# Altium project light_controller.PrjPcb
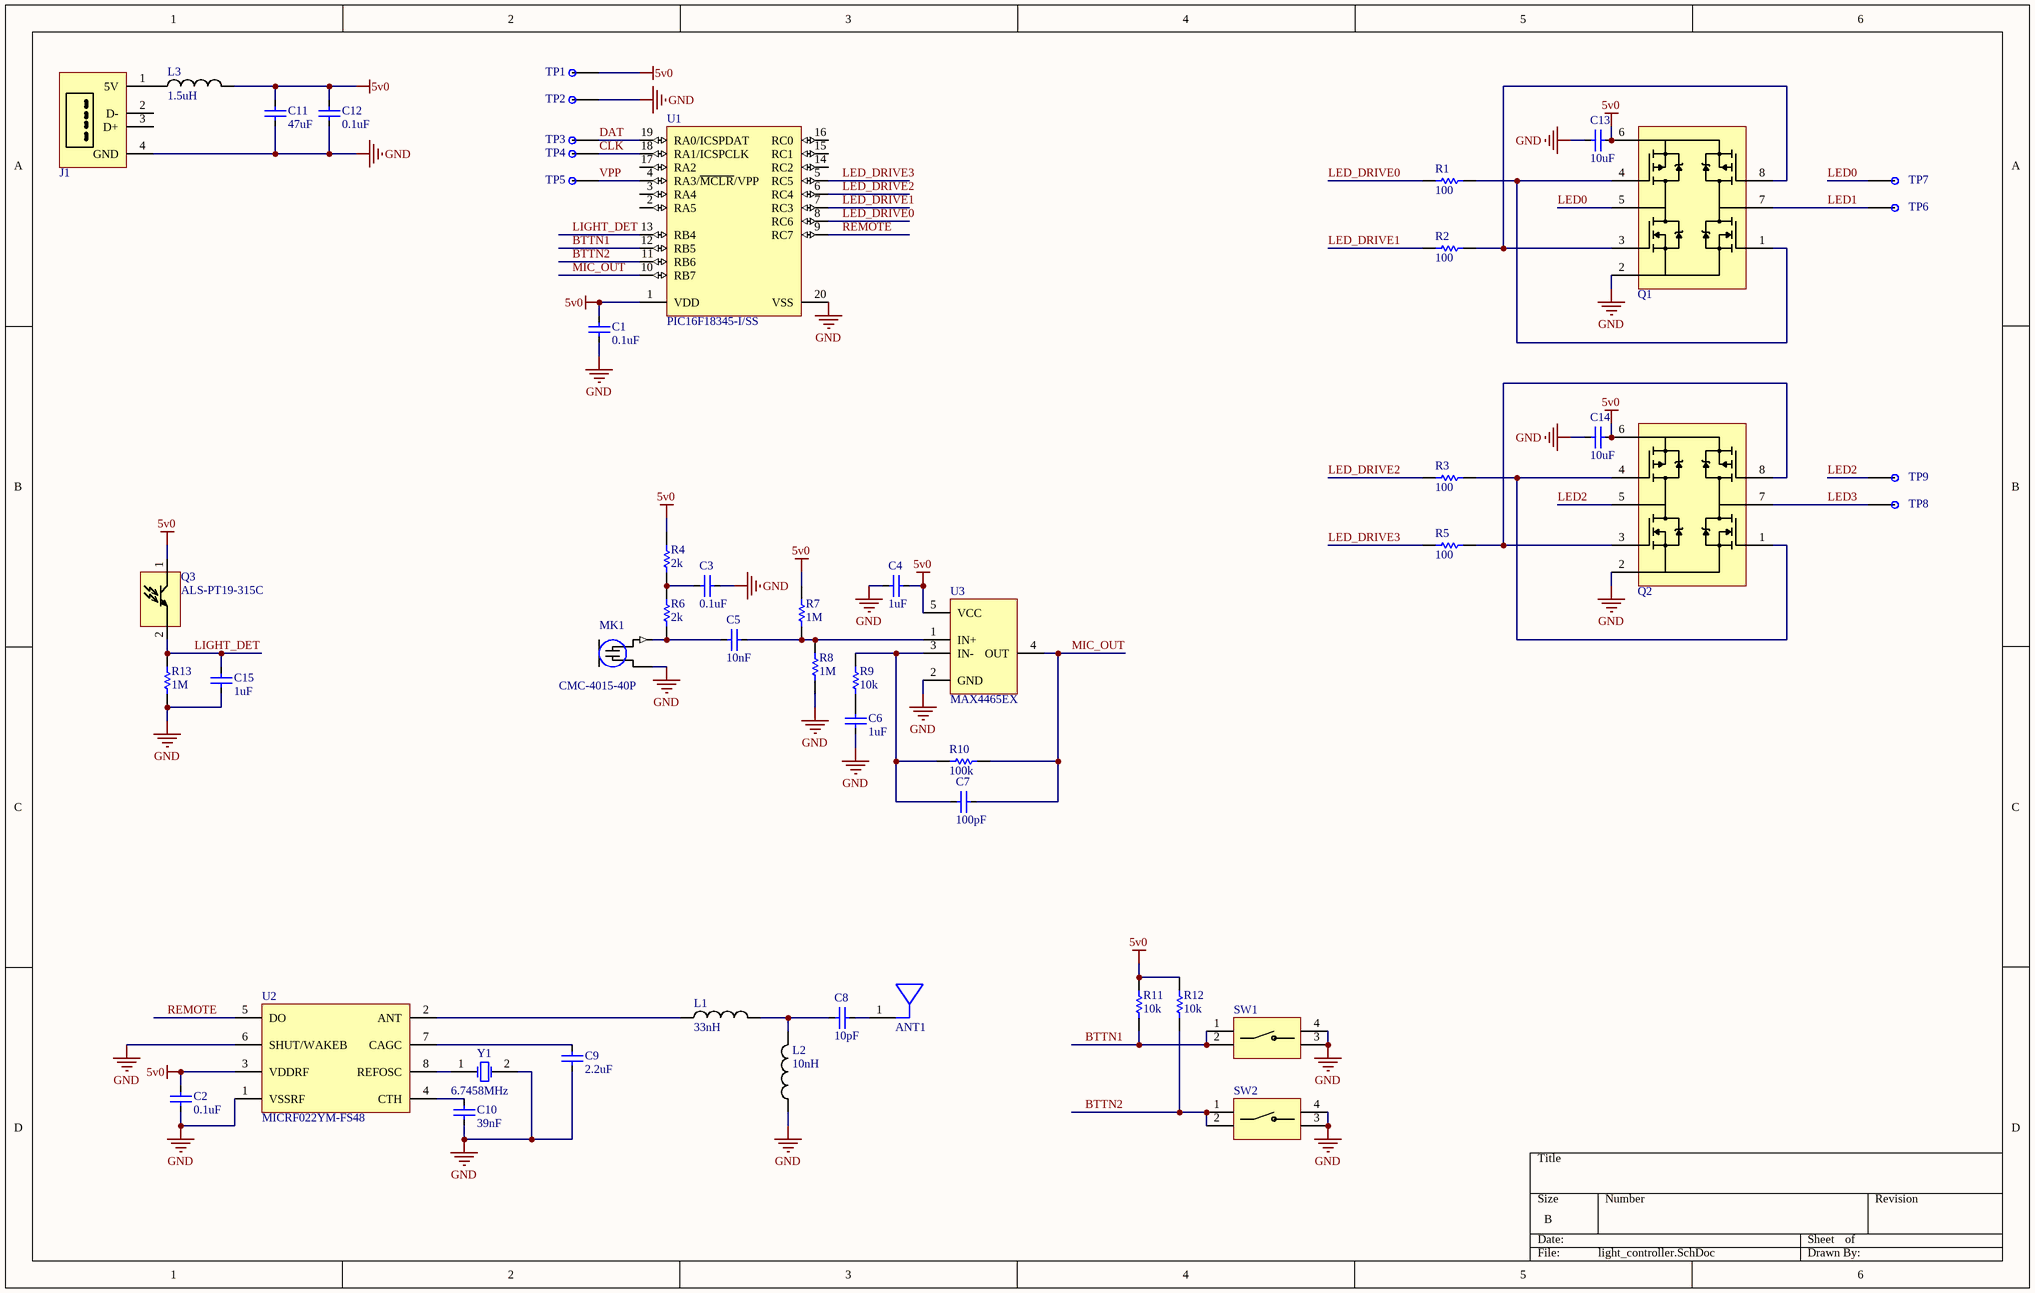
[diagram p0: light_controller.SchDoc]
1 sheet, 52 parts. Net scope: global (net labels, ports and power ports of the same name join across sheets).
Board file: light_controller.PcbDoc

## Sheet light_controller.SchDoc
size B

### Parts
ANT1  CHIP ANTENNA  [ANT-2.4-CHP]  (value not drawn)
C1  0.1uF  [CAP_0603]
C2  0.1uF  [CAP_0603]
C3  0.1uF  [CAP_0603]
C4  1uF  [CAP_0603]
C5  10nF  [CAP_0603]
C6  1uF  [CAP_0603]
C7  100pF  [CAP_0603]
C8  10pF  [CAP_0603]
C9  2.2uF  [CAP_0603]
C10  39nF  [CAP_0603]
C11  47uF  [CAP_0805]
C12  0.1uF  [CAP_0603]
C13  10uF  [CAP_0805]
C14  10uF  [CAP_0805]
C15  1uF  [CAP_0603]
J1  USB-A  [USB_VERT_PLUG]  (value not drawn)
L1  33nH  [RES_0603]
L2  10nH  [RES_0603]
L3  1.5uH  [RES_0805]
MK1  CMC-4015-40P  [MIC_CMC-4015-40P_CMC-4015-40P(Primary)]
Q1  ZXMHC6A07T8TA  [SOT-223-8]  (value not drawn)
Q2  ZXMHC6A07T8TA  [SOT-223-8]  (value not drawn)
Q3  ALS-PT19-315C  [LED_ALS-PT19]
R1  100  [RES_0603]
R2  100  [RES_0603]
R3  100  [RES_0603]
R4  2k  [RES_0603]
R5  100  [RES_0603]
R6  2k  [RES_0603]
R7  1M  [RES_0603]
R8  1M  [RES_0603]
R9  10k  [RES_0603]
R10  100k  [RES_0603]
R11  10k  [RES_0603]
R12  10k  [RES_0603]
R13  1M  [RES_0603]
SW1  PUSHBUTTON-SPST-4Term  [SWITCH_TACTILE_6MM]  (value not drawn)
SW2  PUSHBUTTON-SPST-4Term  [SWITCH_TACTILE_6MM]  (value not drawn)
TP1  TESTPOINT  [PAD_40MIL]  (value not drawn)  (no BOM)
TP2  TESTPOINT  [PAD_40MIL]  (value not drawn)  (no BOM)
TP3  TESTPOINT  [PAD_40MIL]  (value not drawn)  (no BOM)
TP4  TESTPOINT  [PAD_40MIL]  (value not drawn)  (no BOM)
TP5  TESTPOINT  [PAD_40MIL]  (value not drawn)  (no BOM)
TP6  TESTPOINT  [THROUGH_HOLE_20AWG]  (value not drawn)  (no BOM)
TP7  TESTPOINT  [THROUGH_HOLE_20AWG]  (value not drawn)  (no BOM)
TP8  TESTPOINT  [THROUGH_HOLE_20AWG]  (value not drawn)  (no BOM)
TP9  TESTPOINT  [THROUGH_HOLE_20AWG]  (value not drawn)  (no BOM)
U1  PIC16F18345-I/SS  [MCHP-SS-20_V]
U2  MICRF022YM-FS48  [SOIC127P600X175-8N]
U3  MAX4465EX  [SOT95P245X110-5N]
Y1  Frequency: 6.7458MHz  [XTAL_ABLS]  (hidden comment: CRYSTAL)

### Nets
5v0: C1.1 C2.1 C4.2 C11.1 C12.1 C13.2 C14.2 L3.2 Q1.6(S1S4) Q2.6(S1S4) Q3.1(C) R4.2 R7.2 R11.2 R12.2 TP1.1 U1.1(VDD) U2.3(VDDRF) U3.5(VCC)
GND: C1.2 C2.2 C3.2 C4.1 C6.1 C9.1 C10.1 C11.2 C12.2 C13.1 C14.1 C15.1 J1.4(GND) L2.1 MK1.M(GND) Q1.2(S2S3) Q2.2(S2S3) R8.1 R13.1 SW1.3 SW1.4 SW2.3 SW2.4 TP2.1 U1.20(VSS) U2.1(VSSRF) U2.6(SHUT/WAKEB) U3.2(GND) Y1.2(X2)
BTTN1: R11.1 SW1.1 SW1.2 U1.12(RB5)
BTTN2: R12.1 SW2.1 SW2.2 U1.11(RB6)
CLK: TP4.1 U1.18(RA1/ICSPCLK)
DAT: TP3.1 U1.19(RA0/ICSPDAT)
LED0: Q1.5(D1D2) TP7.1
LED1: Q1.7(D3D4) TP6.1
LED2: Q2.5(D1D2) TP9.1
LED3: Q2.7(D3D4) TP8.1
LED_DRIVE0: R1.1 U1.8(RC6)
LED_DRIVE1: R2.1 U1.7(RC3)
LED_DRIVE2: R3.1 U1.6(RC4)
LED_DRIVE3: R5.1 U1.5(RC5)
LIGHT_DET: C15.2 Q3.2(E) R13.2 U1.13(RB4)
MIC_OUT: C7.1 R10.1 U1.10(RB7) U3.4(OUT)
REMOTE: U1.9(RC7) U2.5(DO)
VPP: TP5.1 U1.4(RA3/~{MCLR}/VPP)
NetANT1_1: ANT1.1(FEED) C8.2
NetC3_1: C3.1 R4.1 R6.2
NetC5_1: C5.1 MK1.P(OUT) R6.1
NetC5_2: C5.2 R7.1 R8.2 U3.1(IN+)
NetC6_2: C6.2 R9.1
NetC7_2: C7.2 R9.2 R10.2 U3.3(IN-)
NetC8_1: C8.1 L1.2 L2.2
NetC9_2: C9.2 U2.7(CAGC)
NetC10_2: C10.2 U2.4(CTH)
NetJ1_1: J1.1(5V) L3.1
NetL1_1: L1.1 U2.2(ANT)
NetQ1_1: Q1.1(G3) Q1.4(G1) R1.2
NetQ1_3: Q1.3(G2) Q1.8(G4) R2.2
NetQ2_1: Q2.1(G3) Q2.4(G1) R3.2
NetQ2_3: Q2.3(G2) Q2.8(G4) R5.2
NetU2_8: U2.8(REFOSC) Y1.1(X1)

Not connected (* = marked no-connect by the designer): ANT1 2(NC); J1 2(D-) 3(D+); U1 2(RA5) 3(RA4) 14(RC2) 15(RC1) 16(RC0) 17(RA2)

### Notes on the sheet
- Title
- Date
- GM Cruise LLC Confidential. Subject to Non-Disclosure Agreement.
- GM Cruise LLC
- Number
- Sheet
- Revision
- of

### Library data of the parts
ANT1 = CHIP ANTENNA: Two terminal chip antenna
C1-C15 = CAPACITOR
  C3: Capacitance: 0.1uF
  C4 C6 C15: Capacitance: 1uF
  C5: Capacitance: 10nF
  C7: Capacitance: 100pF
  C8: Capacitance: 10pF
  C9: Capacitance: 2.2uF
  C10: Capacitance: 39nF
  C11: Capacitance: 47uF
  C13 C14: Capacitance: 10uF
L1-L3 = INDUCTOR
  L1: Inductance: 33nH
  L2: Inductance: 10nH
  L3: Inductance: 1.5uH
Q1 Q2 = H-BRIDGE MOSFET ARRAY: Mosfet Array 2 N and 2 P-Channel (H-Bridge) 60V 1.6A, 1.3A 1.3W Surface Mount SM8
Q3 = PHOTOTRANSISTOR
R1-R13 = RESISTOR
  R1-R3 R5: Resistance: 100
  R4 R6: Resistance: 2k
  R7 R8 R13: Resistance: 1M
  R9 R11 R12: Resistance: 10k
  R10: Resistance: 100k
SW1 SW2 = PUSHBUTTON-SPST-4Term: SPST pushbutton - four terminal
TP1-TP9 = TESTPOINT: Test Point; Part Number: TestPoint SMT 40mil
U1 = CMP-2000-06894-1: Full-Featured, Low Pin Count Microcontrollers with XLP, 8 Bit, 14 KB, 1024 RAM, 1.8 to 5.5 V, -40 to 85 degC, 20-Pin SSOP (SS), RoHS, Tube; Manufacturer: Microchip-Technology; Program Memory Type: FLASH; EEPROM Size: 256x8; Core Processor: PIC; Voltage - Supply (Vcc/Vdd): 2.3V~5.5V; Data Converters: A/D17x10b,D/A1x5b; Oscillator Type: Internal; RAM Size: 1Kx8; Peripherals: Brown-outDetect/Reset,POR,PWM,WDT; Program Memory Size: 14KB(8Kx14); Core Size: 8-Bit; Speed: 32MHz; Number of I/O: 18; Connectivity: I²C,LIN,SPI,UART/USART; Packaging: Tube; Datasheet Version: Rev. C, 10/2016; Operating Temperature: -40°C~85°C(TA); Manufacturer URL: http://www.microchip.com/; Family: Embedded-Microcontrollers; Mounting Technology: SurfaceMount; Datasheet URL: http://ww1.microchip.com/downloads/en/DeviceDoc/40001795C.pdf; Supplier Device Package: 20-SSOP; Package Reference: SS-20; Package Description: 20-Pin Shrink Small Outline Package Integrated Circuit, Body 7.2 x 5.3 mm, Pitch 0.65 mm; Package URL: http://ww1.microchip.com/downloads/en/PackagingSpec/00000049CE.pdf; Series: PIC®XLP™16F; Category: IntegratedCircuits(ICs)
U2 = MICRF022YM-FS48: - RF Receiver ASK, OOK 300MHz ~ 440MHz -97dBm 10 kbps PCB, Surface Mount 8-SOIC
U3 = MAX4466: Amplifier IC 1-Channel (Mono) Class AB SC-70-5
MK1 = CMC-4015-40P: Value: *
Y1 = CRYSTAL: ComponentLink1URL: http://www.abracon.com/; ComponentLink2Description: Datasheet; ComponentLink2URL: http://www.abracon.com/Resonators/ABLS2.pdf; ComponentLink1Description: Manufacturer URL